# Altium project IoTa.PrjPcb
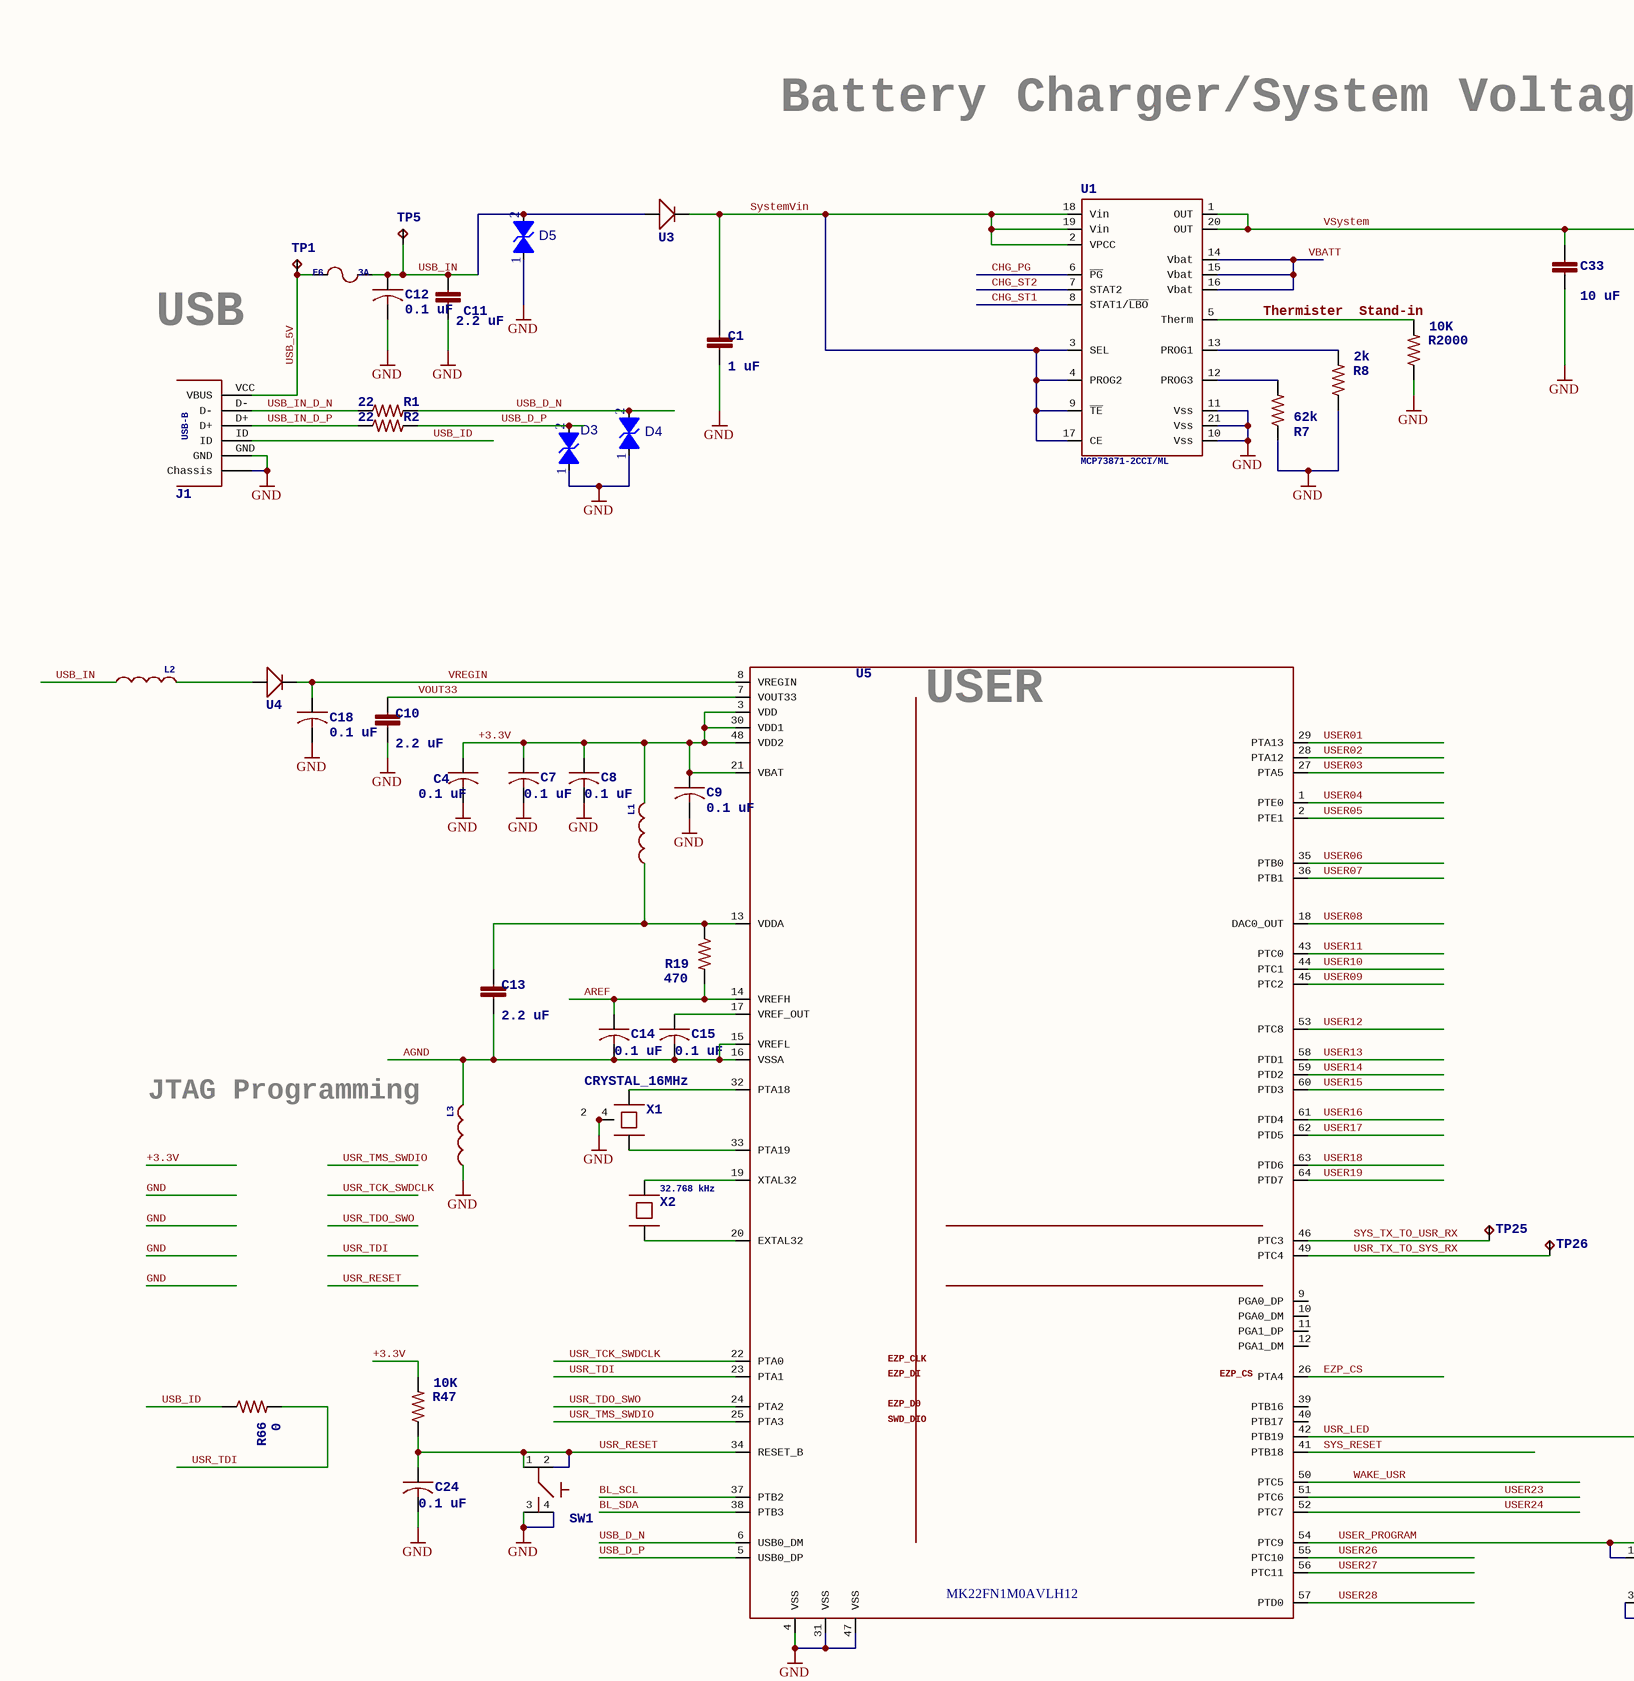
[diagram p0: IoTa_1_0.SchDoc, top left]
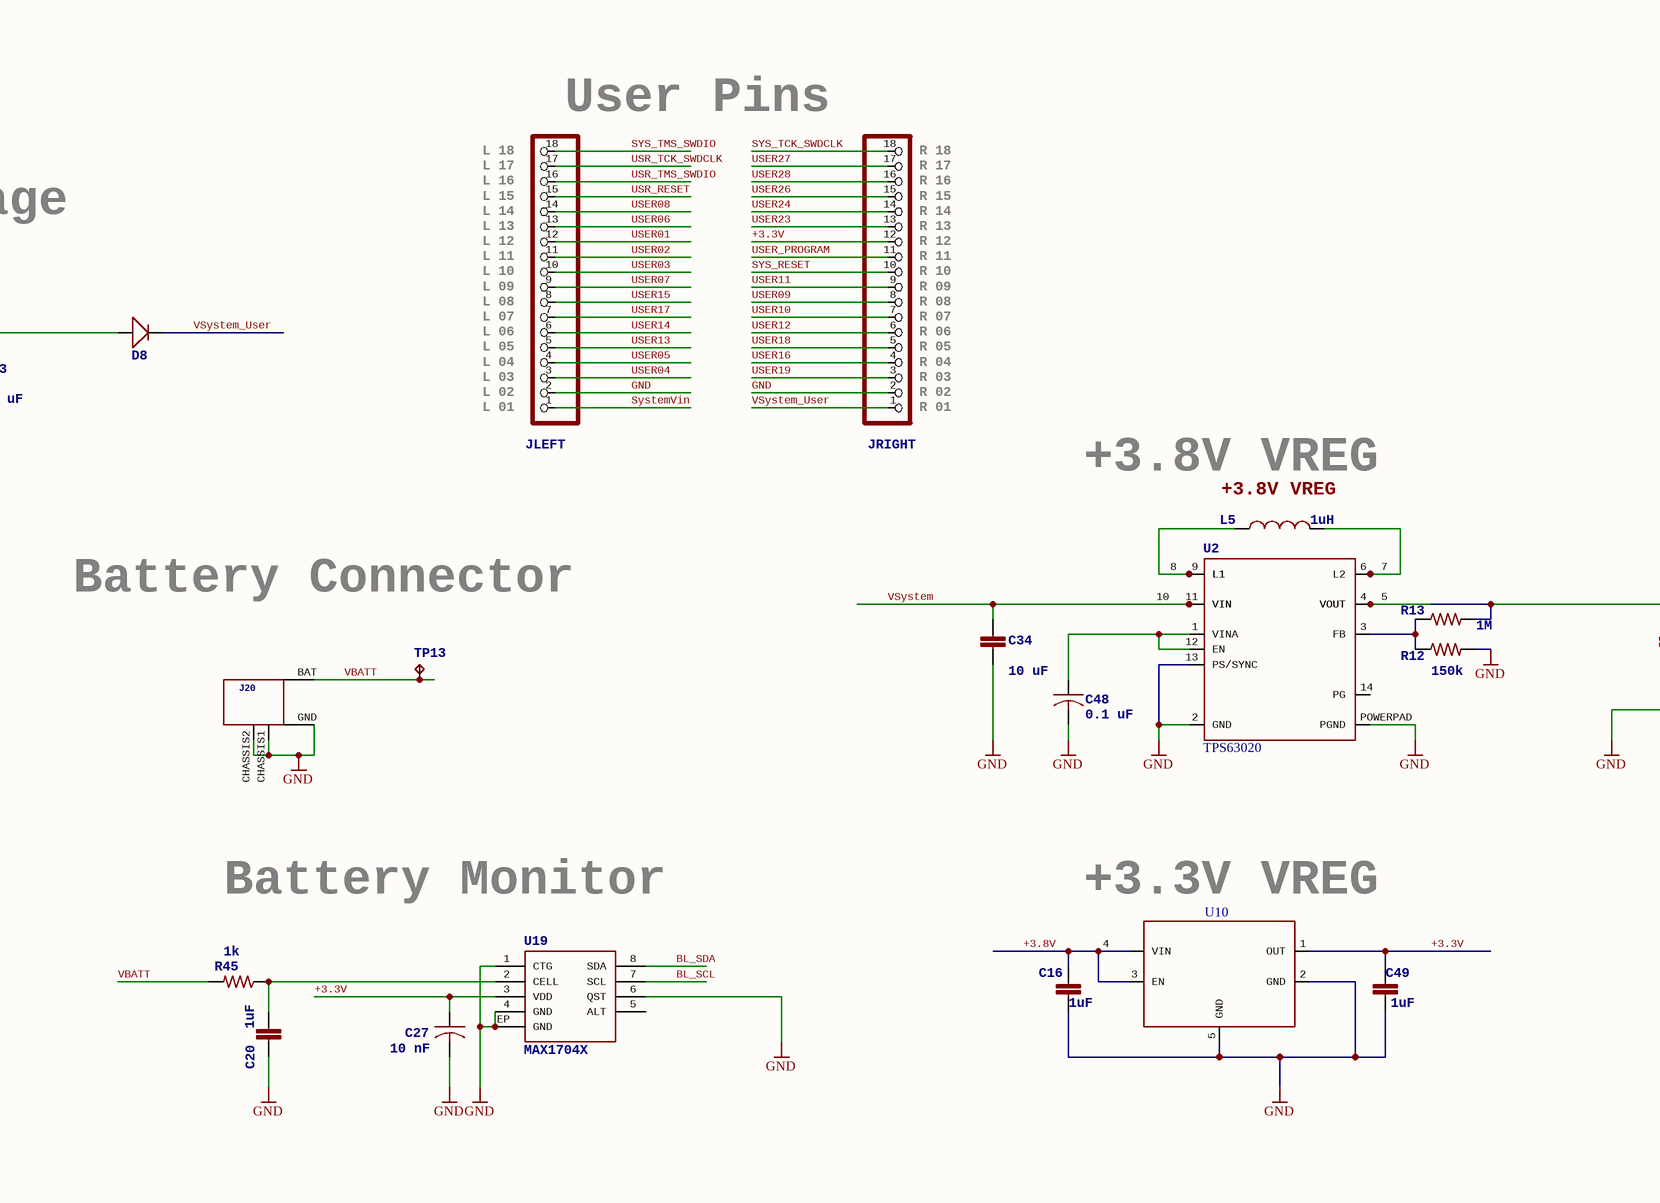
[diagram p1: IoTa_1_0.SchDoc, top middle]
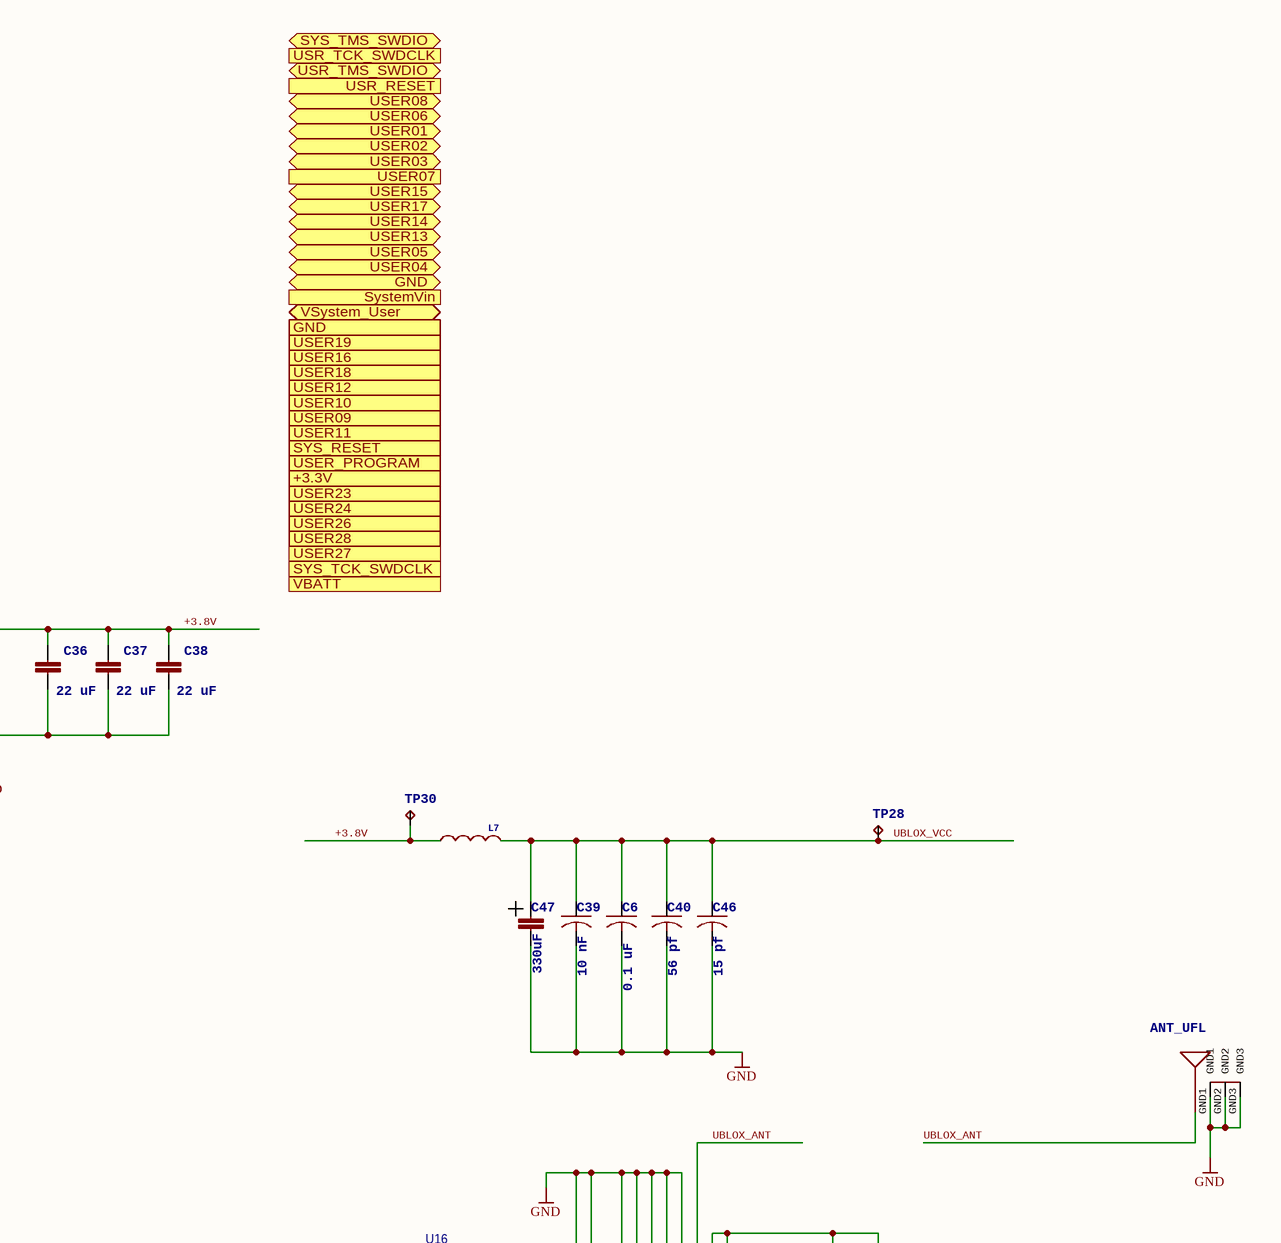
[diagram p2: IoTa_1_0.SchDoc, top right]
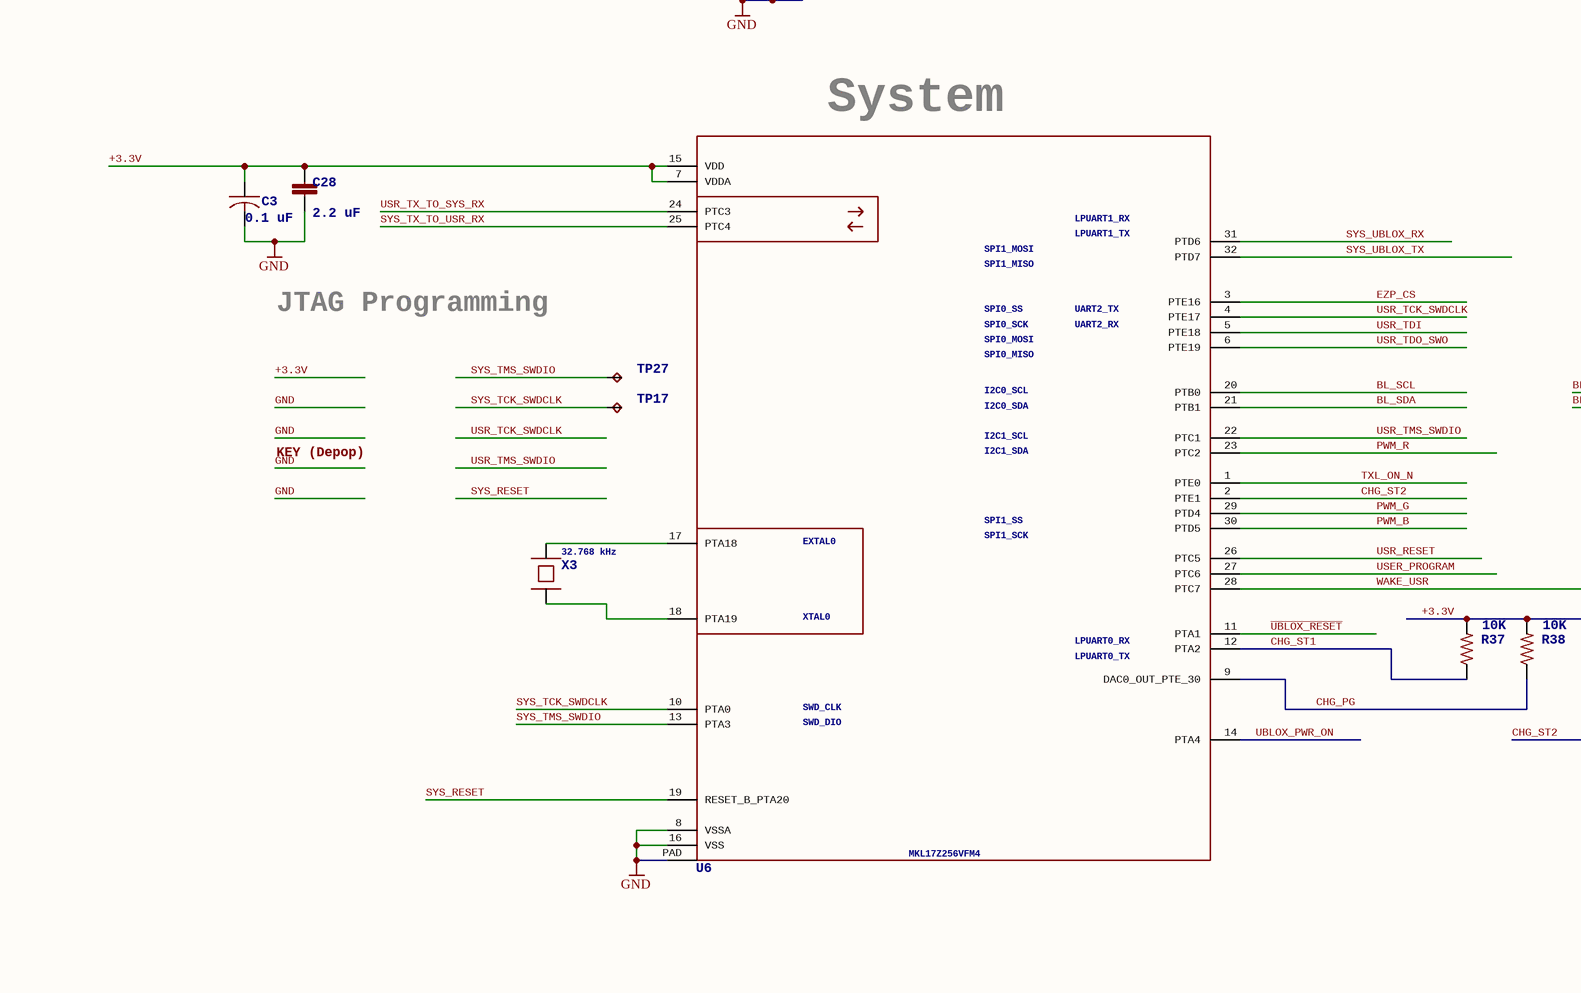
[diagram p3: IoTa_1_0.SchDoc, bottom left]
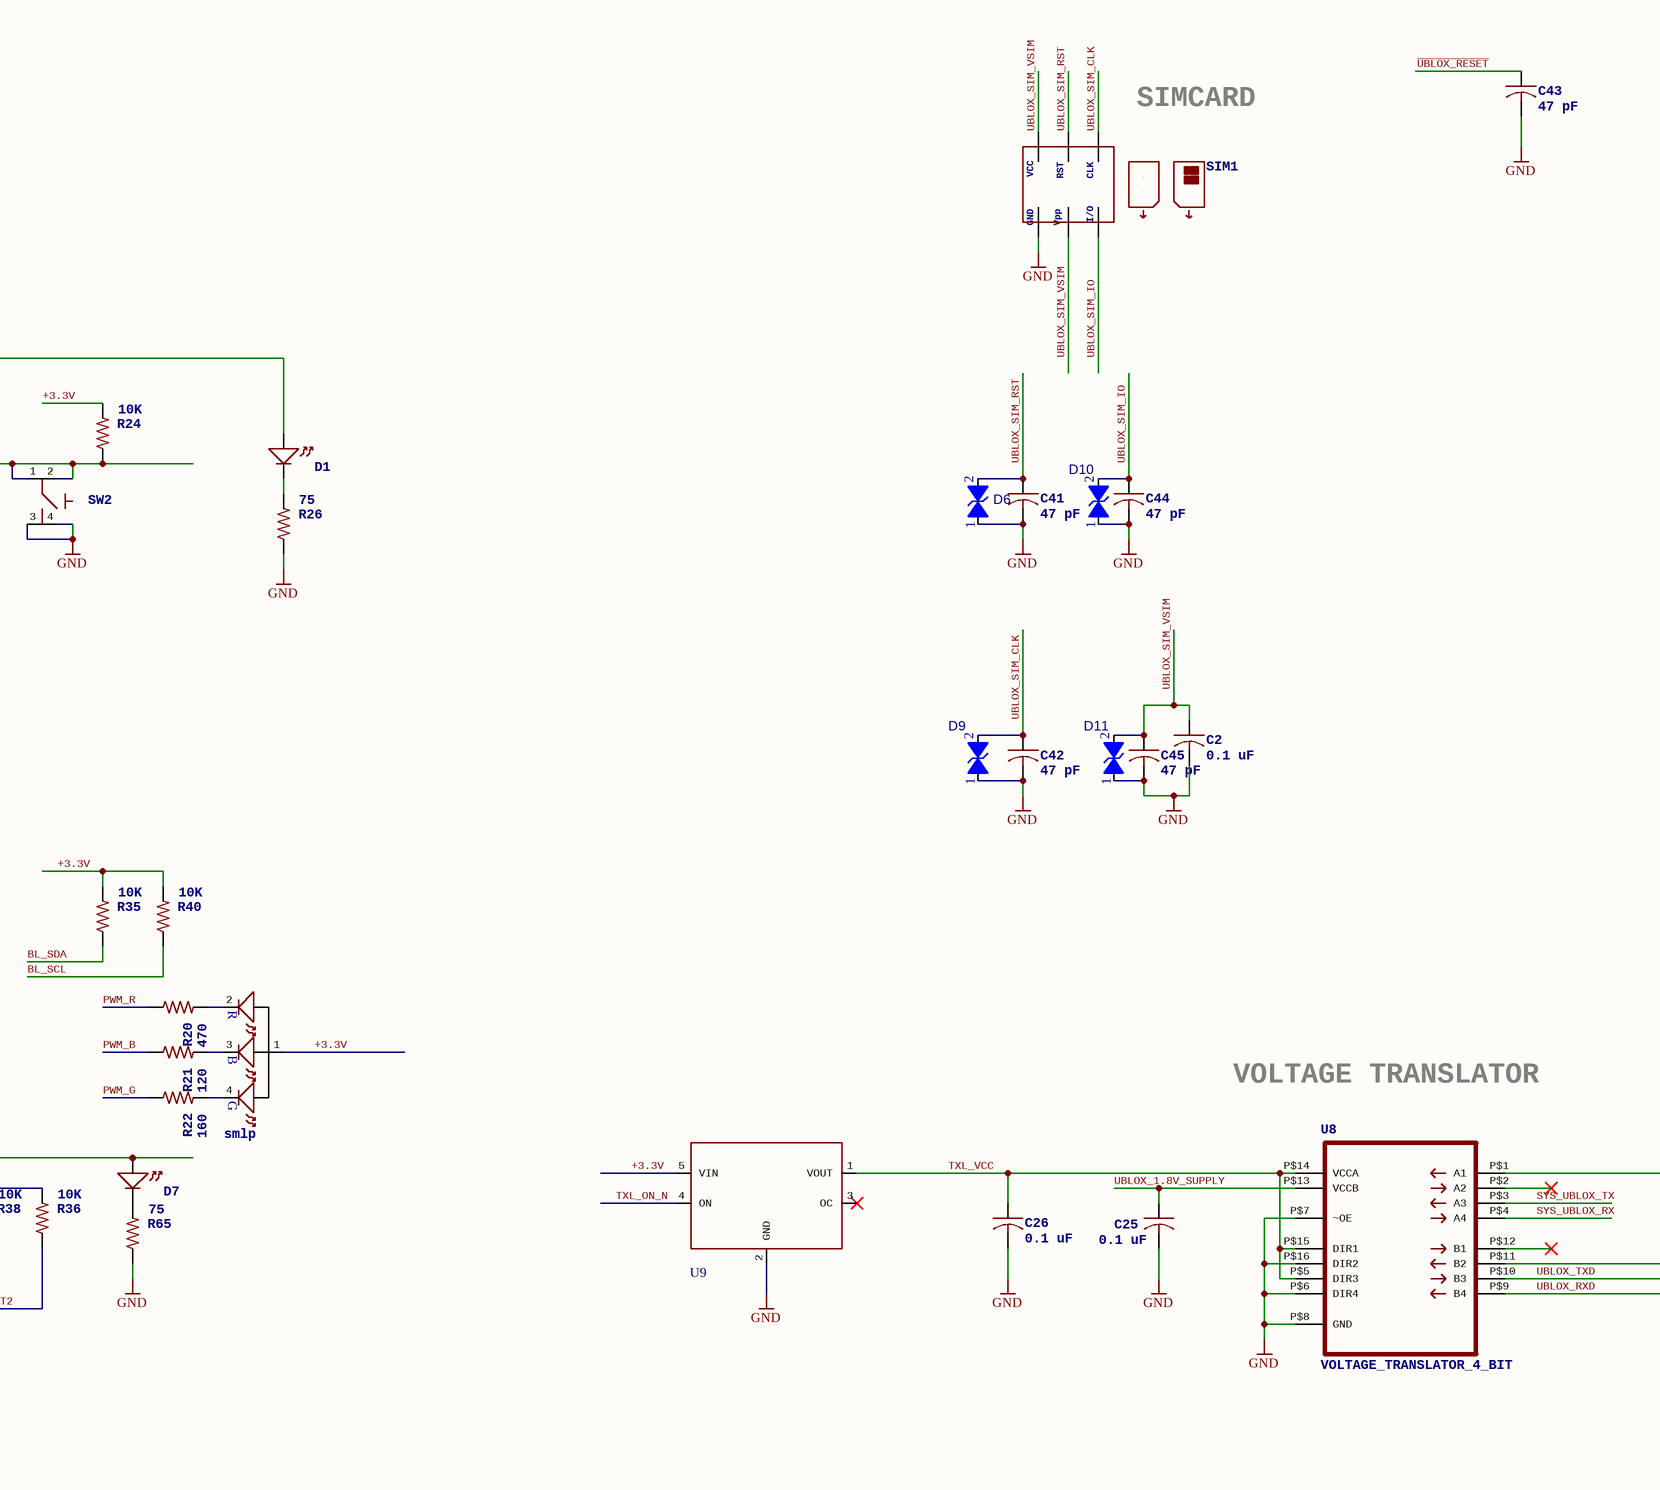
[diagram p4: IoTa_1_0.SchDoc, bottom middle]
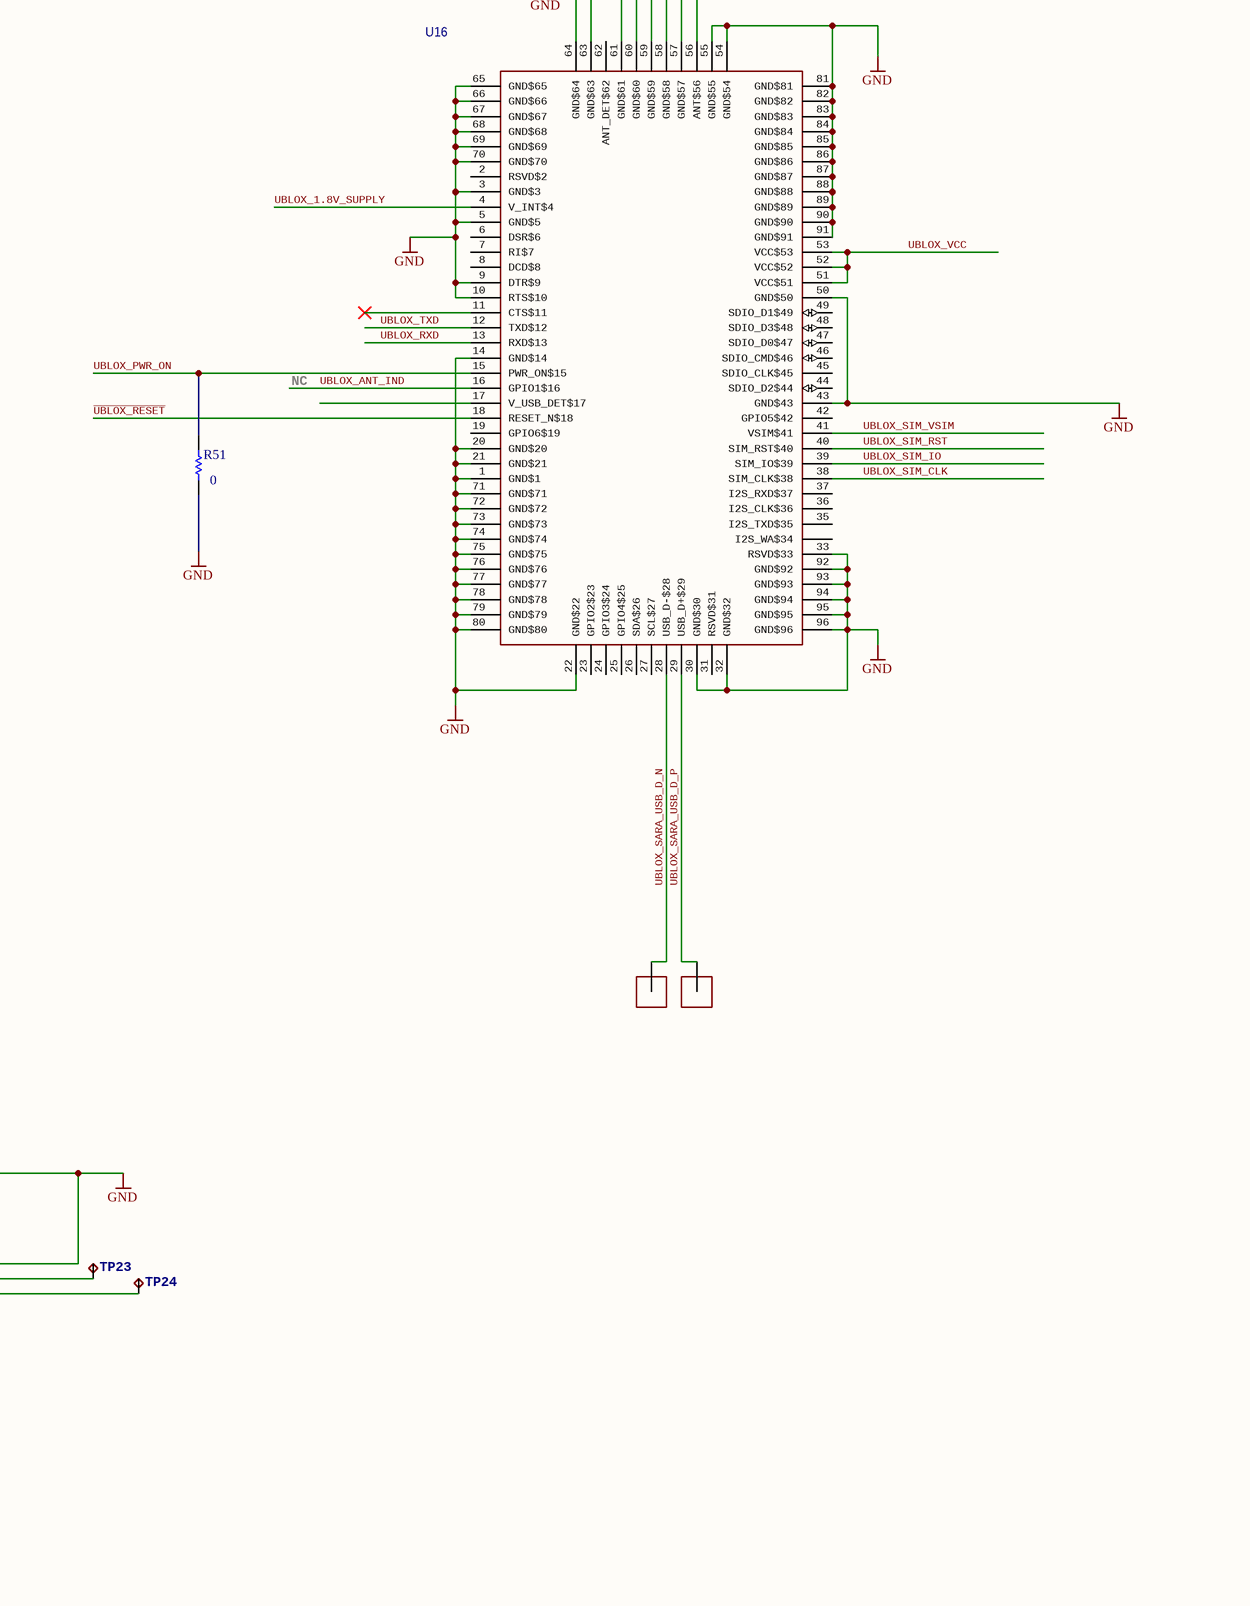
[diagram p5: IoTa_1_0.SchDoc, bottom right]
1 sheet, 113 parts. Net scope: flat (ports and power ports of the same name join across sheets).
Board file: IoTa_1_0.PcbDoc

## Sheet IoTa_1_0.SchDoc: POEM Technology IoTa
size D; Date: 5/4/2016 12:37:24 PM; Author: A. Stillman; Engineer: A. Stillman; Organization: POEM Technology; Revision: 1.0; SheetNumber: 1; SheetTotal: 1; CAGE Code: 85NZ1; CurrentTime: Then; CurrentDate: Now; DocumentFullPathAndName: KON-SU260

### Parts
ANT_UFL  ANT-A-1JB  [UFL]  (value not drawn)
C1  1 uF  [CAP0603]
C2  0.1 uF  [CAP0402]
C3  0.1 uF  [CAP0402]
C4  0.1 uF  [CAP0402]
C6  0.1 uF  [CAP0402]
C7  0.1 uF  [CAP0402]
C8  0.1 uF  [CAP0402]
C9  0.1 uF  [CAP0402]
C10  2.2 uF  [CAP0603]
C11  2.2 uF  [CAP0603]
C12  0.1 uF  [CAP0402]
C13  2.2 uF  [CAP0603]
C14  0.1 uF  [CAP0402]
C15  0.1 uF  [CAP0402]
C16  1uF  [CAP0402]
C18  0.1 uF  [CAP0402]
C20  1uF  [CAP0402]
C24  0.1 uF  [CAP0402]
C25  0.1 uF  [CAP0402]
C26  0.1 uF  [CAP0402]
C27  10 nF  [CAP0402]
C28  2.2 uF  [CAP0603]
C33  10 uF  [CAP0603]
C34  10 uF  [CAP0603]
C36  22 uF  [CAP0603]
C37  22 uF  [CAP0603]
C38  22 uF  [CAP0603]
C39  10 nF  [CAP0402]
C40  56 pf  [CAP0402]
C41  47 pF  [CAP0402]
C42  47 pF  [CAP0402]
C43  47 pF  [CAP0402]
C44  47 pF  [CAP0402]
C45  47 pF  [CAP0402]
C46  15 pf  [CAP0402]
C47  330uF  [CAP1210POL]
C48  0.1 uF  [CAP0402]
C49  1uF  [CAP0402]
D1  LED_0402_VLMW  [LED_0402_VISHAY_VLMW]  (value not drawn)
D3  (no value)  [PESD_0402]
D4  (no value)  [PESD_0402]
D5  (no value)  [PESD_0402]
D6  (no value)  [PESD_0402]
D7  LED_0402_VLMW  [LED_0402_VISHAY_VLMW]  (value not drawn)
D8  CDBQR0230L  [DIODE_0402]  (value not drawn)
D9  (no value)  [PESD_0402]
D10  (no value)  [PESD_0402]
D11  (no value)  [PESD_0402]
F6  3A  [RES0603]
J1  Micro USB B FCI 10118193  [USB_MICRO_FCI_10118193]  (value not drawn)
J20  BAT_TERM_TOP_ENTRY  [JST-PH-2-Top]  (value not drawn)
JLEFT  22-28-4180  [1X18]  (value not drawn)
JRIGHT  22-28-4180  [1X18]  (value not drawn)
L1  FerriteBead_220ohm  [RES0603]  (value not drawn)
L2  FerriteBead_220ohm  [RES0603]  (value not drawn)
L3  FerriteBead_220ohm  [RES0603]  (value not drawn)
L5  1uH  [COILCRAFT_XFL4020]
L7  FerriteBead_220ohm  [RES0603]  (value not drawn)
R1  22  [RES0402]
R2  22  [RES0402]
R7  62k  [RES0402]
R8  2k  [RES0402]
R12  150k  [RES0402]
R13  1M  [RES0402]
R19  470  [RES0402]
R20  470  [RES0402]
R21  120  [RES0402]
R22  160  [RES0402]
R24  10K  [RES0402]
R26  75  [RES0402]
R35  10K  [RES0402]
R36  10K  [RES0402]
R37  10K  [RES0402]
R38  10K  [RES0402]
R40  10K  [RES0402]
R45  1k  [RES0402]
R47  10K  [RES0402]
R51  0  [RESC2013X50X30LL20T20]
R65  75  [RES0402]
R66  0  [RES0402]
R2000  10K  [RES0402]
SIM1  SIM_CARD_NANO  [SIM_CARD_NANO]  (value not drawn)
smlp  LED_RGB_1mm_sq  [LED-RGB-1X1]  (value not drawn)
SW1  SWITCH_PTS810  [SWITCH_PTS810]  (value not drawn)
SW2  SWITCH_PTS810  [SWITCH_PTS810]  (value not drawn)
TP1  TPTP08R  [TP08R]  (value not drawn)  (no BOM)
TP5  TPTP08R  [TP08R]  (value not drawn)  (no BOM)
TP13  TPTP08R  [TP08R]  (value not drawn)  (no BOM)
TP17  TPTP08R  [TP08R]  (value not drawn)  (no BOM)
TP23  TPTP08R  [TP08R]  (value not drawn)  (no BOM)
TP24  TPTP08R  [TP08R]  (value not drawn)  (no BOM)
TP25  TPTP08R  [TP08R]  (value not drawn)  (no BOM)
TP26  TPTP08R  [TP08R]  (value not drawn)  (no BOM)
TP27  TPTP08R  [TP08R]  (value not drawn)  (no BOM)
TP28  TPTP08R  [TP08R]  (value not drawn)  (no BOM)
TP30  TPTP08R  [TP08R]  (value not drawn)  (no BOM)
U1  MPN: MCP73871-2CCI/ML  [QFN50P400X400X80_20_pin]  (hidden comment: MICROCHIP_73871)
U2  TPS63020  [QFN-14-POWERPAD3X4DSJ]
U3  CDBQR0230L  [SODFL350X99-2N]  (value not drawn)
U4  CDBQR0230L  [SODFL350X99-2N]  (value not drawn)
U5  MPN: MK22FN1M0AVLH12  [LQFP-64N]  (hidden comment: MK22FN1M0VLH12)
U6  FREESCALE_MKL17Z256VFM4  [QFN50P50]  (value not drawn)
U8  VOLTAGE_TRANSLATOR_4_BIT  [UQFN_16]
U9  (no value)  [SC70-5]
U10  (no value)  [REG_NCP160AMX180TBG]
U16  SARA-R410  [SARA]  (value not drawn)
U19  MAX1704X  [TDFN-8]
U$1  TESTPAD  [TESTPAD]  (value not drawn)  (no BOM)
U$2  TESTPAD  [TESTPAD]  (value not drawn)  (no BOM)
X1  CRYSTAL_16MHz  [CRYSTAL-SMD-2X1.6]
X2  32.768 kHz  [CRYSTAL_ABS05]
X3  32.768 kHz  [CRYSTAL_ABS05]

### Ports
+3.3V, GND, GND (bidir), SYS_RESET, SYS_TCK_SWDCLK, SYS_TMS_SWDIO (bidir), SystemVin (in), USER01 (bidir), USER02 (bidir), USER03 (bidir), USER04 (bidir), USER05 (bidir), USER06 (bidir), USER07, USER08 (bidir), USER09, USER10, USER11, USER12, USER13 (bidir), USER14 (bidir), USER15 (bidir), USER16, USER17 (bidir), USER18, USER19, USER23, USER24, USER26, USER27, USER28, USER_PROGRAM, USR_RESET (in), USR_TCK_SWDCLK, USR_TMS_SWDIO (bidir), VBATT (in), VSystem_User (bidir)

### Nets
GND: ANT_UFL.GND1 ANT_UFL.GND2 ANT_UFL.GND3 C1.2 C2.2 C3.2 C4.2 C6.2 C7.2 C8.2 C9.2 C10.2 C11.2 C12.2 C16.2 C18.2 C20.2 C24.2 C25.2 C26.2 C27.2 C28.2 C33.2 C34.2 C36.2 C37.2 C38.2 C39.2 C40.2 C41.2 C42.2 C43.2 C44.2 C45.2 C46.2 C47.2 C48.2 C49.2 D3.1 D4.1 D5.1 D6.1 D9.1 D10.1 D11.1 J1.GND J20.CHASSIS1(CHASSIS_1) J20.CHASSIS2(CHASSIS_2) J20.GND JLEFT.2 JRIGHT.2 L3.2(P$2) R7.1 R8.1 R12.2 R26.1 R51.1 R65.1 R2000.1 SIM1.C5(GND) SW1.3(P$1) SW1.4(P$2) SW2.3(P$1) SW2.4(P$2) U1.10(Vss) U1.11(Vss) U1.21(Vss) U2.2(GND) U2.13(PS/SYNC) U2.POWERPAD(PGND) U5.4(VSS) U5.31(VSS) U5.47(VSS) U6.8(VSSA) U6.16(VSS) U6.PAD(VSS) U8.P$1(A1) U8.P$6(DIR4) U8.P$7(~OE) U8.P$8(GND) U8.P$11(B2) U8.P$16(DIR2) U9.2(GND) U10.2(GND) U10.5(GND) U16.1(GND$1) U16.3(GND$3) U16.5(GND$5) U16.9(DTR$9) U16.10(RTS$10) U16.14(GND$14) U16.20(GND$20) U16.21(GND$21) U16.22(GND$22) U16.30(GND$30) U16.32(GND$32) U16.33(RSVD$33) U16.43(GND$43) U16.50(GND$50) U16.54(GND$54) U16.55(GND$55) U16.57(GND$57) U16.58(GND$58) U16.59(GND$59) U16.60(GND$60) U16.61(GND$61) U16.63(GND$63) U16.64(GND$64) U16.65(GND$65) U16.66(GND$66) U16.67(GND$67) U16.68(GND$68) U16.69(GND$69) U16.70(GND$70) U16.71(GND$71) U16.72(GND$72) U16.73(GND$73) U16.74(GND$74) U16.75(GND$75) U16.76(GND$76) U16.77(GND$77) U16.78(GND$78) U16.79(GND$79) U16.80(GND$80) U16.81(GND$81) U16.82(GND$82) U16.83(GND$83) U16.84(GND$84) U16.85(GND$85) U16.86(GND$86) U16.87(GND$87) U16.88(GND$88) U16.89(GND$89) U16.90(GND$90) U16.91(GND$91) U16.92(GND$92) U16.93(GND$93) U16.94(GND$94) U16.95(GND$95) U16.96(GND$96) U19.1(CTG) U19.4(GND) U19.6(QST) U19.EP(GND) X1.2 X1.4
+3.3V: C3.1 C4.1 C7.1 C8.1 C9.1 C27.1 C28.1 C49.1 JRIGHT.12 L1.1(P$1) R24.2 R35.2 R36.2 R37.2 R38.2 R40.2 R47.2 smlp.1(Common_ANODE) U5.3(VDD) U5.21(VBAT) U5.30(VDD1) U5.48(VDD2) U6.7(VDDA) U6.15(VDD) U9.5(VIN) U10.1(OUT) U19.3(VDD)
+3.8V: C16.1 C36.1 C37.1 C38.1 L7.2(P$2) R13.2 TP30.TP U2.4(VOUT) U2.5(VOUT) U10.3(EN) U10.4(VIN)
~{UBLOX_RESET}: C43.1 U6.11(PTA1) U16.18(RESET_N$18)
AGND: C13.2 C14.2 C15.2 L3.1(P$1) U5.15(VREFL) U5.16(VSSA)
AREF: C14.1 R19.2 U5.14(VREFH)
BL_SCL: R40.1 U5.37(PTB2) U6.20(PTB0) U19.7(SCL)
BL_SDA: R35.1 U5.38(PTB3) U6.21(PTB1) U19.8(SDA)
CHG_PG: R38.1 U1.6(~{PG}) U6.9(DAC0_OUT_PTE_30)
CHG_ST1: R37.1 U1.8(STAT1/~{LBO}) U6.12(PTA2)
CHG_ST2: R36.1 U1.7(STAT2) U6.2(PTE1)
EZP_CS: U5.26(PTA4) U6.3(PTE16)
PWM_B: R21.1 U6.30(PTD5)
PWM_G: R22.1 U6.29(PTD4)
PWM_R: R20.1 U6.23(PTC2)
SYS_RESET: JRIGHT.10 U5.41(PTB18) U6.19(RESET_B_PTA20)
SYS_TCK_SWDCLK: JRIGHT.18 TP17.TP U6.10(PTA0)
SYS_TMS_SWDIO: JLEFT.18 TP27.TP U6.13(PTA3)
SYS_TX_TO_USR_RX: TP25.TP U5.46(PTC3) U6.25(PTC4)
SYS_UBLOX_RX: U6.31(PTD6) U8.P$4(A4)
SYS_UBLOX_TX: U6.32(PTD7) U8.P$3(A3)
SystemVin: C1.1 JLEFT.1 U1.2(VPCC) U1.3(SEL) U1.4(PROG2) U1.9(~{TE}) U1.17(CE) U1.18(Vin) U1.19(Vin) U3.CATHODE
TXL_ON_N: U6.1(PTE0) U9.4(ON)
TXL_VCC: C26.1 U8.P$5(DIR3) U8.P$14(VCCA) U8.P$15(DIR1) U9.1(VOUT)
UBLOX_1.8V_SUPPLY: C25.1 U8.P$13(VCCB) U16.4(V_INT$4)
UBLOX_ANT: ANT_UFL.SIGNAL U16.56(ANT$56)
UBLOX_ANT_IND: U16.16(GPIO1$16)
UBLOX_PWR_ON: R51.2 U6.14(PTA4) U16.15(PWR_ON$15)
UBLOX_RXD: TP24.TP U8.P$9(B4) U16.13(RXD$13)
UBLOX_SARA_USB_D_N: U16.28(USB_D-$28) U$2.P$1
UBLOX_SARA_USB_D_P: U16.29(USB_D+$29) U$1.P$1
UBLOX_SIM_CLK: C42.1 D9.2 SIM1.C3(CLK) U16.38(SIM_CLK$38)
UBLOX_SIM_IO: C44.1 D10.2 SIM1.C7(IO) U16.39(SIM_IO$39)
UBLOX_SIM_RST: C41.1 D6.2 SIM1.C2(RST) U16.40(SIM_RST$40)
UBLOX_SIM_VSIM: C2.1 C45.1 D11.2 SIM1.C1(VCC) SIM1.C6(VCC2) U16.41(VSIM$41)
UBLOX_TXD: TP23.TP U8.P$10(B3) U16.12(TXD$12)
UBLOX_VCC: C6.1 C39.1 C40.1 C46.1 C47.1 L7.1(P$1) TP28.TP U16.51(VCC$51) U16.52(VCC$52) U16.53(VCC$53)
USB_5V: F6.1(P$1) J1.VCC(VBUS) TP1.TP
USB_D_N: D4.2 R1.2 U5.6(USB0_DM)
USB_D_P: D3.2 R2.2 U5.5(USB0_DP)
USB_ID: J1.ID R66.1
USB_IN: C11.1 C12.1 D5.2 F6.2(P$2) L2.2(P$2) TP5.TP U3.ANODE
USB_IN_D_N: J1.D- R1.1
USB_IN_D_P: J1.D+ R2.1
USER01: JLEFT.12 U5.29(PTA13)
USER02: JLEFT.11 U5.28(PTA12)
USER03: JLEFT.10 U5.27(PTA5)
USER04: JLEFT.3 U5.1(PTE0)
USER05: JLEFT.4 U5.2(PTE1)
USER06: JLEFT.13 U5.35(PTB0)
USER07: JLEFT.9 U5.36(PTB1)
USER08: JLEFT.14 U5.18(DAC0_OUT)
USER09: JRIGHT.8 U5.45(PTC2)
USER10: JRIGHT.7 U5.44(PTC1)
USER11: JRIGHT.9 U5.43(PTC0)
USER12: JRIGHT.6 U5.53(PTC8)
USER13: JLEFT.5 U5.58(PTD1)
USER14: JLEFT.6 U5.59(PTD2)
USER15: JLEFT.8 U5.60(PTD3)
USER16: JRIGHT.4 U5.61(PTD4)
USER17: JLEFT.7 U5.62(PTD5)
USER18: JRIGHT.5 U5.63(PTD6)
USER19: JRIGHT.3 U5.64(PTD7)
USER23: JRIGHT.13 U5.51(PTC6)
USER24: JRIGHT.14 U5.52(PTC7)
USER26: JRIGHT.15 U5.55(PTC10)
USER27: JRIGHT.17 U5.56(PTC11)
USER28: JRIGHT.16 U5.57(PTD0)
USER_PROGRAM: JRIGHT.11 R24.1 SW2.1(P$1) SW2.2(P$1) U5.54(PTC9) U6.27(PTC6)
USR_LED: D1.ANODE U5.42(PTB19)
USR_RESET: C24.1 JLEFT.15 R47.1 SW1.1(P$1) SW1.2(P$1) U5.34(RESET_B) U6.26(PTC5)
USR_TCK_SWDCLK: JLEFT.17 U5.22(PTA0) U6.4(PTE17)
USR_TDI: R66.2 U5.23(PTA1) U6.5(PTE18)
USR_TDO_SWO: U5.24(PTA2) U6.6(PTE19)
USR_TMS_SWDIO: JLEFT.16 U5.25(PTA3) U6.22(PTC1)
USR_TX_TO_SYS_RX: TP26.TP U5.49(PTC4) U6.24(PTC3)
VBATT: J20.BAT R45.2 TP13.TP U1.14(Vbat) U1.15(Vbat) U1.16(Vbat)
VOUT33: C10.1 U5.7(VOUT33)
VREGIN: C18.1 U4.CATHODE U5.8(VREGIN)
VSystem: C33.1 C34.1 D8.ANODE U1.1(OUT) U1.20(OUT) U2.10(VIN) U2.11(VIN)
VSystem_User: D8.CATHODE JRIGHT.1
WAKE_USR: D7.ANODE U5.50(PTC5) U6.28(PTC7)
NetC13_1: C13.1 L1.2(P$2) R19.1 U5.13(VDDA)
NetC15_1: C15.1 U5.17(VREF_OUT)
NetC20_1: C20.1 R45.1 U19.2(CELL)
NetC48_1: C48.1 U2.1(VINA) U2.12(EN)
NetD1_CATHODE: D1.CATHODE R26.2
NetD7_CATHODE: D7.CATHODE R65.2
NetL2_1: L2.1(P$1) U4.ANODE
NetL5_P$1: L5.P$1 U2.8(L1) U2.9(L1)
NetL5_P$2: L5.P$2 U2.6(L2) U2.7(L2)
NetR7_2: R7.2 U1.12(PROG3)
NetR8_2: R8.2 U1.13(PROG1)
NetR12_1: R12.1 R13.1 U2.3(FB)
NetR20_2: R20.2 smlp.2(CATHODE_R)
NetR21_2: R21.2 smlp.3(CATHODE_B)
NetR22_2: R22.2 smlp.4(CATHODE_G)
NetR2000_2: R2000.2 U1.5(Therm)
NetU5_19: U5.19(XTAL32) X2.2(XTAL2)
NetU5_20: U5.20(EXTAL32) X2.1(XTAL1)
NetU5_32: U5.32(PTA18) X1.1
NetU5_33: U5.33(PTA19) X1.3
NetU6_17: U6.17(PTA18) X3.2(XTAL2)
NetU6_18: U6.18(PTA19) X3.1(XTAL1)

Not connected (* = marked no-connect by the designer): SIM1 MTG1(NC1) MTG2(NC2); U2 14(PG); U5 9(PGA0_DP) 10(PGA0_DM) 11(PGA1_DP) 12(PGA1_DM) 39(PTB16) 40(PTB17); U8 P$2(A2)* P$12(B1)*; U9 3(OC)*; U16 2(RSVD$2) 6(DSR$6) 7(RI$7) 8(DCD$8) 11(CTS$11)* 17(V_USB_DET$17) 19(GPIO6$19) 23(GPIO2$23) 24(GPIO3$24) 25(GPIO4$25) 26(SDA$26) 27(SCL$27) 31(RSVD$31) 34(I2S_WA$34) 35(I2S_TXD$35) 36(I2S_CLK$36) 37(I2S_RXD$37) 42(GPIO5$42) 44(SDIO_D2$44) 45(SDIO_CLK$45) 46(SDIO_CMD$46) 47(SDIO_D0$47) 48(SDIO_D3$48) 49(SDIO_D1$49) 62(ANT_DET$62); U19 5(ALT)

### Notes on the sheet
- (near JLEFT) L 17
- (near JLEFT) L 18
- (near JLEFT) User Pins
- (near JRIGHT) R 17
- (near JRIGHT) R 18
- Battery Charger/System Voltage
- (near JLEFT) L 12
- (near JLEFT) L 13
- (near JLEFT) L 14
- (near JLEFT) L 15
- (near JLEFT) L 16
- (near JRIGHT) R 12
- (near JRIGHT) R 13
- (near JRIGHT) R 14
- (near JRIGHT) R 15
- (near JRIGHT) R 16
- (near JLEFT) L 07
- (near JLEFT) L 08
- (near JLEFT) L 09
- (near JLEFT) L 10
- (near JLEFT) L 11
- (near JRIGHT) R 07
- (near JRIGHT) R 08
- (near JRIGHT) R 09
- (near JRIGHT) R 10
- (near JRIGHT) R 11
- (near JLEFT) L 02
- (near JLEFT) L 03
- (near JLEFT) L 04
- (near JLEFT) L 05
- (near JLEFT) L 06
- (near JRIGHT) R 02
- (near JRIGHT) R 03
- (near JRIGHT) R 04
- (near JRIGHT) R 05
- (near JRIGHT) R 06
- USB
- (near R2000) Thermister
  Stand-in
- (near JLEFT) L 01
- (near JRIGHT) R 01
- (near L5) +3.8V VREG
- Battery Connector
- (near U5) USER
- Battery Monitor
- (near U10) +3.3V VREG
- JTAG Programming
- (near SIM1) SIMCARD
- (near U5) EZP_CLK
- (near U5) EZP_DI
- (near U5) EZP_D0
- (near U5) SWD_DIO
- (near U5) EZP_CS
- NC
- (near U6) System
- KEY (Depop)
- VOLTAGE TRANSLATOR
- Title
- POEM Technology, LLC
- Size:
- Date:
- File:
- D
- Number:
- Time:
- Revision:
- Sheet
- of
- 100 Terminal Dr.
- Plainview, NY 11803
- (in symbol LED_RGB_1mm_sq) R; B; G

### Library data of the parts
ANT_UFL = ANT-A-1JB: Amphenol; MPN: A-1JB; MFG: Amphenol; Internal PN: CON-0006
C1 = CAP1uF_0603: Capacitor, 1 uF, 0603; MPN: GRM188R71C105KA12D; MFG: MURATA; PACKAGE: 0603; Internal PN: CAP-0001
C2-C4 C6-C9 C12 C14 C15 C18 C24-C26 C48 = CAP0.1uF_0402: CAPACITOR, 0.1 uF, 0402; MPN: GRM155R61C104KA88D; MFG: MURATA; PKG: 0402; Internal PN: CAP-0004
C10 C11 C13 C28 = CAP2.2uF_0603: Capacitor, 2.2 uF, 0603; MPN: CL10A225MQ8NNNC; MFG: SAMSUNG; PACKAGE: 0603; Internal PN: CAP-0002
C16 C20 C49 = CAP1uF_0402: CAPACITOR, 1uF, 0402; MPN: 04026D105KAT2A; MFG: AVX; PACKAGE: 0402; Internal PN: CAP-0005
C27 C39 = CAP10nF_0402: CAPACITOR, 10 nF, 0402; MPN: GRM155R71C103KA01D; MFG: MURATA; PKG: 0402; Internal PN: CAP-0016
C33 C34 = CAP10uF_0603: Capacitor, 10 uF, 0603; MPN: GRM188R60J106ME84D; MFG: Murata; Internal PN: CAP-0007
C36-C38 = CAP22uF_0603: Capacitor, 22 uF, 0603; MPN: GRM188R60J226MEA0D; MFG: MURATA; PACKAGE: 0603; Internal PN: CAP-0008
C40 = CAP56pF_0402: CAPACITOR, 56 pF, 0402; MPN: C0402C560J5GACTU; MFG: KEMET; PACKAGE: 0402; Internal PN: CAP-0009
C41-C45 = CAP47pf_0402: CAPACITOR, 47 pF, 0402; MPN: 04025A470JAT2A; MFG: AVX; PKG: 0402; Internal PN: CAP-0010
  C43: Supplier 1: Arrow Electronics; Supplier Part Number 1: GRM1555C1H470JA01D; Supplier 2: Arrow Electronics; Supplier Part Number 2: C0402C470J5GACTU; Supplier 3: Arrow Electronics; Supplier Part Number 3: 04025A470JAT2A; Supplier 4: Arrow Electronics; Supplier Part Number 4: 04025A470FAT2A
C46 = CAP15pF_0402: CAPACITOR, 15 pF, 0402; MPN: 04025A150JAT2A; MFG: AVX/ELCO; PACKAGE: 0402; Internal PN: CAP-0011
C47 = CAP330uF_1210P: Capacitor, 330 uF, 1210, Polarized Tantalum; MPN: F950J337MBAAQ2; MFG: AVX; PACKAGE: 1210; Internal PN: CAP-0012
D1 D7 = LED_0402_VLMW: LED, Vishay White 0402; MPN: VLMW1500-GS08; MFG: VISHAY; PACKAGE: 0402; Internal PN: DIO-0002
D3-D6 D9-D11 = PESD_14V: DIODE,ZENER VOLTAGE SUPPRESSOR,+/-14V; MPN: PESD0402-140; MFG: Littlefuse; Internal PN: DIO-0009
D8 = DIODE_0402_200mA: Schottky Barrier Diode, 200 mA, 30 V, 0402 package; MFG: Comchip; MPN: CDBQR0230L; PACKAGE: 0402; Internal PN: DIO-0004
F6 = FUSE_0603: Fuse, 3A, 0603; MPN: SF-0603S300-2; MFG: Bourns; Internal PN: FUS-0001
J1 = USB_MICRO_B_FCI_10118193: Connector, Micro USB B, FCI; MPN: 10118193-0001LF; MFG: Amphenol FCI; USB-B: USB-B; Internal PN: CON-0009
J20 = BAT_TERM_TOP_ENTRY: Battery Connector JST-PH2 Top Entry; MPN: B2B-PH-SM4-TB(LF)(SN); MFG: JST; Internal PN: CON-0010
JLEFT JRIGHT = PINHD-1X18: Header, Male, 1x18, 0.1"; MFG: MOLEX; MPN: 22-28-4180; Internal PN: CON-0011
L1-L3 L7 = FerriteBead_220ohm: FerriteBead, 220ohm; MPN: BLM18AG121SN1D; MFG: Murata; Internal PN: IND-0001
L5 = INDUCTOR_1UH_XFL4020-102MEC: Inductor, 1 uH, Coilcraft; MPN: XFL4020-102MEC; MFG: Coilcraft; Internal PN: IND-0003
R1 R2 = RES22R_0402: Resistor, 22 ohm, 0402 case, 1%; MPN: RC0402FR-0722RL; MFG: YAEGO; PACKAGE: 0402; Internal PN: RES-0016
R7 = RES62K_0402_1: Resistor, 62K ohm, 0402 case; MPN: RC0402FR-0762KL; MFG: YAEGO; PACKAGE: 0402; Internal PN: RES-0017
R8 = RES2K_0402: Resistor, 2K ohm, 0402 case; MPN: RC0402FR-072KL; MFG: YAEGO; PACKAGE: 0402; Internal PN: RES-0015
R12 = RES150K_0402: Res, 150k ohm, 0402 case, 1%; MPN: RC0402FR-07150KL; MFG: YAEGO; PACKAGE: 0402; Internal PN: RES-0004
R13 = RES1M_0402: Resistor, 1M ohm, 0402 case, 1%; MPN: RC0402FR-071ML; MFG: YAEGO; PACKAGE: 0402; Internal PN: RES-0014
R19 R20 = RES470R_0402: Resistor, 470 ohm, 0402 case, 1%; MPN: ERJ-2GEJ471X; MFG: PANASONIC; PACKAGE: 0402; Internal PN: RES-0006
R21 = RES120R_0402: Resistor, 120 ohm, 0402 case, 1%; MPN: ERJ-2GEJ121X; MFG: PANASONIC; PACKAGE: 0402; Internal PN: RES-0019
R22 = RES160R_0402: Resistor, 160 ohm, 0402 case, 1%; MPN: ERJ-2GEJ161X; MFG: PANASONIC; PACKAGE: 0402; Internal PN: RES-0020
R24 R35-R38 R40 R47 R2000 = RES10K_0402: Resistor, 10k ohm, 0402; MPN: RC0402JR-0710KL; MFG: YAEGO; PACKAGE: 0402; Internal PN: RES-0008
R26 R65 = RES75R_0402: Resistor, 75 ohm, 0402, 1%; MPN: RC0402FR-0775RL; MFG: YAEGO; PACKAGE: 0402; Internal PN: RES-0018
R45 = RES1K_0402: Resistor, 1k, 0402 case, 1%; MPN: RC0402JR-071KL; MFG: YAEGO; PACKAGE: 0402; Internal PN: RES-0002
R51 = CMP-2001-04896-1: Manufacturer: Vishay Dale; Part Number: CRCW08050000Z0EA; Value: 0
R66 = RES0R_0402: Resistor, 0 ohm, 0402; MPN: ERJ-2GE0R00X; MFG: PANASONIC; PACKAGE: 0402; Internal PN: RES-0011
SIM1 = SIM_CARD_NANO: Connector, SIM Card,Nano; MPN: SIM8050-6-0-14-01-A; MFG: GLOBAL CONNECTOR TECHNOLOGY; PACKAGE: CUSTOM; VCC: VCC; RST: RST; CLK: CLK; I/O: I/O; Vpp: Vpp; GND: GND; Internal PN: CON-0007
smlp = LED_RGB_1mm_sq: LED, Tri-color, RGB, 1mm sq; MPN: SMLP34RGB1W3; MFG: Rohm; PACKAGE: LED_SQ_1x1; Internal PN: DIO-0006; Supplier 1: Digi-Key; Supplier Part Number 1: 846-SMLP34RGBN1W3CT-ND
SW1 SW2 = SWITCH_PTS810: Switch, C&K, PTS810; MPN: PTS810 SJM 250 SMTR LFS; MFG: C&K Components; PACKAGE: PTS810; Internal PN: SWI-0001
TP1 TP5 TP13 TP17 TP23-TP28 TP30 = TPTP08R: Test pad; MFG: N/A; MPN: N/A
U1 = MICROCHIP_73871: Stand-alone Load Sharing and LiPo Battery Charge management controller; Internal PN: IC-0012; MFG: MICROCHIP
U2 = TPS63020: Regulator, Boost Buck, Adjustable, 3A; MPN: TPS63020DSJ; MFG: TI; Internal PN: IC-0013; PACKAGE: QFN_14_3x4; Supplier 1: Digi-Key; Supplier Part Number 1: 296-27230-6-ND; Supplier 2: Digi-Key; Supplier Part Number 2: 296-37448-1-ND
U3 U4 = DIODE_SOD123F_1A: Schottky Barrier Diode, 1.5 A, 30 V, 0402 package; MPN: CRS08(TE85L,Q,M); MFG: Toshiba Semiconductor and Storage; PACKAGE: SOD-123F; Internal PN: DIO-0005
U5 = MK22FN1M0VLH12: ARM® Cortex®-M4 Kinetis K20 Microcontroller IC 32-Bit 120MHz 1MB (1M x 8) FLASH 64-LQFP (10x10); MFG: Freescale; Internal PN: IC-0008
U6 = FREESCALE_MKL17Z256VFM4: Microprocessor, Freescale, MKL17Z256VFM4; Internal PN: IC-0009; MFG: FREESCALE; MPN: MKL17Z256VFM4; PACKAGE: QFN32_5x5; SPI0_SS: SPI0_SS; UART2_TX: UART2_TX; SPI0_SCK: SPI0_SCK; UART2_RX: UART2_RX; SPI0_MOSI: SPI0_MOSI; SPI0_MISO: SPI0_MISO; SWD_CLK: SWD_CLK; SWD_DIO: SWD_DIO; EXTAL0: EXTAL0; XTAL0: XTAL0; LPUART0_RX: LPUART0_RX; LPUART0_TX: LPUART0_TX; I2C0_SCL: I2C0_SCL; I2C0_SDA: I2C0_SDA; LPUART1_TX: LPUART1_TX; SPI1_SS: SPI1_SS; SPI1_SCK: SPI1_SCK; SPI1_MOSI: SPI1_MOSI; MKL17Z256VFM4: MKL17Z256VFM4; SPI1_MISO: SPI1_MISO; I2C1_SCL: I2C1_SCL; I2C1_SDA: I2C1_SDA; LPUART1_RX: LPUART1_RX
U8 = VOLTAGE_TRANSLATOR_4_BIT: IC, Voltage Translator, 4-bit; MPN: SN74AVC4T774RSVR; MFG: TI; Internal PN: IC-0011; PACKAGE: UQFN_16
U9 = TPS22945: IC, Current-limited  Load Switch, Active High; MPN: TPS22945DCKR; MFG: Texas Instruments; Internal PN: IC-0017; Supplier 1: Mouser; Supplier Part Number 1: 595-TPS22943DCKR; Supplier 2: Arrow Electronics; Supplier Part Number 2: TPS2065DR; Supplier 3: Arrow Electronics; Supplier Part Number 3: FPF2005
U10 = NCP177-D: IC Regulator, LDO 3.3V 0.5A, 4XDFN; MPN: NCP177AMX330TCG; MFG: On Semi; Internal PN: IC-0002
U16 = SARA-R410M-02B: LTE module for multi-regional use; Cat M1/NB1 deployed bands: 1*, 2, 3, 4, 5, 8, 12, 13, 18, 19, 20, 25, 26*, 28 (* roaming bands); MFG: U-BLOX; Internal PN: IC-0007; MPN: SARA-R410M-02B
U19 = MAX1704X: MAX17043/MAX17044: Battery Fuel Guage (43 is 1cell, 44 is 2cell); MPN: MAX17043G+U; CROSS: NO; MFG: Maxim; PRODUCTION: YES; Internal PN: IC-0003
X1 = CRYSTAL_16MHz: Crystal SMD, 16 MHz; MPN: CX2016DB16000D0WZRC1; MFG: AVX; Internal PN: XTL-0001
X2 X3 = CRYSTAL_32.768K_ABS05: 32.768kHz ±20ppm Crystal 12.5pF 90 kOhm -40°C ~ 85°C Surface Mount 2-SMD; MPN: ABS05-32.768KHZ-T; MFG: Abracon; Internal PN: XTL-0003

## Assembly variants
PT: not fitted C43
StreamSense: not fitted R51
All Components: all parts fitted